# EAGLE design soloG (EAGLE 6.4)
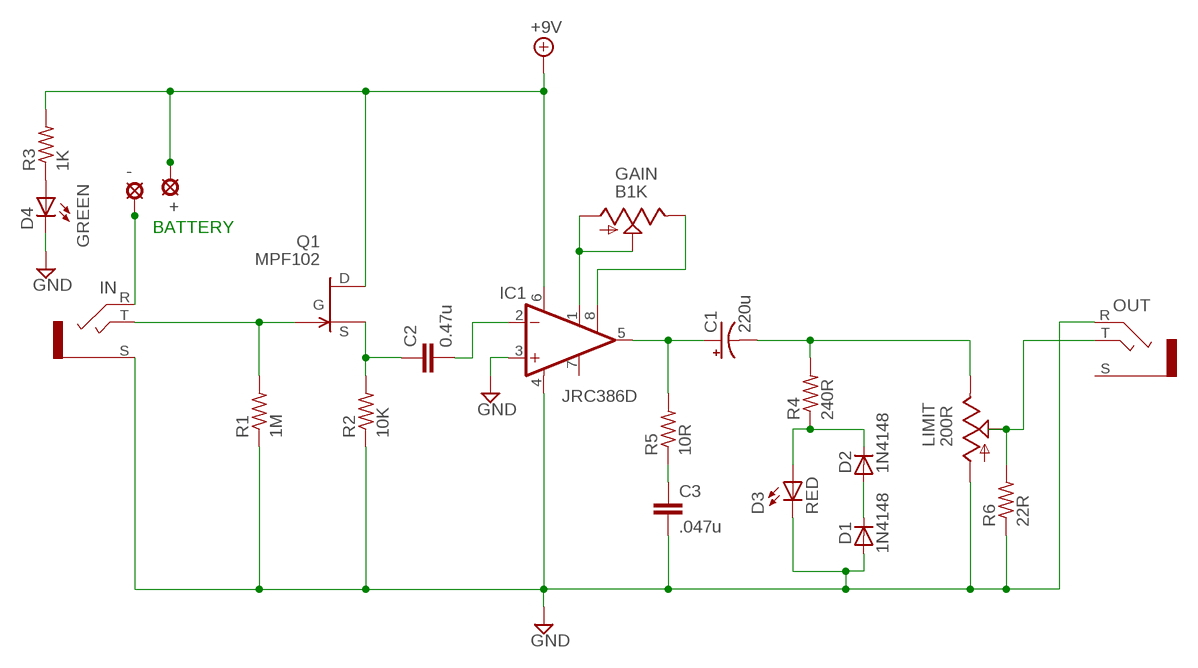
[diagram p0: schematic, sheet 1]

## Parts
+  SOLPAD  [SOLPAD]
-  SOLPAD  [SOLPAD]
C1  220u  CPOL-USE3.5-8  [E3,5-8]
C2  0.47u  C15/5  [C15B5]
C3  .047u  C-EUGREEN-CHIKLET  [C075-040X085_OVAL]
D1  1N4148  1N4148DO35-7  [DO35-7]
D2  1N4148  1N4148DO35-7  [DO35-7]
D3  RED  LED3MM  [LED3MM]
D4  GREEN  LED3MM  [LED3MM]
GAIN  B1K  TRIM_US-PTD901-2015K  [PTD901-2015K]
IC1  JRC386D  [DIP8]
IN  NRJ6-STEREO-HH  [NRJ6HH]
LIMIT  200R  TRIM_US-0655H  [0655-614]
OUT  NRJ6-STEREO-HH  [NRJ6HH]
Q1  MPF102  [TO92-FET]
R1  1M  R-US_0207/7  [0207/7]
R2  10K  R-US_0207/7  [0207/7]
R3  1K  R-US_0207/7  [0207/7]
R4  240R  R-US_0207/7  [0207/7]
R5  10R  R-US_0207/7  [0207/7]
R6  22R  R-US_0207/7  [0207/7]

## Nets
+9V: +.1(MP) IC1.6(VS) Q1.D R3.2
GND: C3.P$2 D1.A D3.K(C) D4.K(C) IC1.3(+IN) IC1.4(GND) IN.S LIMIT.A OUT.R R1.1 R2.1 R6.1
N$1: C1.+ IC1.5(OUT) R5.2
N$2: C2.1 Q1.S R2.2
N$3: GAIN.1(A) GAIN.2(S) IC1.1(GAIN)
N$4: C2.2 IC1.2(-IN)
N$5: -.1(MP) IN.R
N$6: IN.T Q1.G R1.2
N$7: C3.P$1 R5.1
N$8: LIMIT.S OUT.T R6.2
N$9: GAIN.3(E) IC1.8(GAIN)
N$10: D4.A R3.1
N$11: D2.C D3.A R4.1
N$12: C1.- LIMIT.E R4.2
N$14: D1.C D2.A
Unconnected: IC1.7(BYPASS) OUT.S

## Notes on the sheet
- BATTERY

## Library data of the parts
+ - = KK:SOLPAD: Simple solder pad
C1 = rcl:CPOL-US: POLARIZED CAPACITOR, American symbol
C2 = capacitor-wima:C: CAPACITOR naming: grid - package width
C3 = rcl-KK:C-EU: CAPACITOR, European symbol
D1 D2 = diode:1N4148: DIODE high speed (Philips)
D3 D4 = led:LED: LED OSRAM: - CHIPLED LG R971, LG N971, LY N971, LG Q971, LY Q971, LO R971, LY R971 LH N974, LH R974 LS Q976, LO Q976, LY Q976 LO Q996 - Hyper CHIPLED LW Q18S LB Q993, LB Q99A, LB R99A - SideLED LS A670, LO A670, LY A670, LG A670, LP A670 LB A673, LV A673, LT A673, LW A673 LH A674 LY A675 LS A676, LA A676, LO A676, LY A676, LW A676 LS A679, LY A679, LG A679 - Hyper Micro SIDELED® LS Y876, LA Y876, LO Y876, LY Y876 LT Y87S - SmartLED LW L88C, LW L88S LB L89C, LB L89S, LG L890 LS L89K, LO L89K, LY L89K LS L896, LA L896, LO L896, LY L896 - TOPLED LS T670, LO T670, LY T670, LG T670, LP T670 LSG T670, LSP T670, LSY T670, LOP T670, LYG T670 LG T671, LOG T671, LSG T671 LB T673, LV T673, LT T673, LW T673 LH T674 LS T676, LA T676, LO T676, LY T676, LB T676, LH T676, LSB T676, LW T676 LB T67C, LV T67C, LT T67C, LS T67K, LO T67K, LY T67K, LW E67C LS E67B, LA E67B, LO E67B, LY E67B, LB E67C, LV E67C, LT E67C LW T67C LS T679, LY T679, LG T679 LS T770, LO T770, LY T770, LG T770, LP T770 LB T773, LV T773, LT T773, LW T773 LH T774 LS E675, LA E675, LY E675, LS T675 LS T776, LA T776, LO T776, LY T776, LB T776 LHGB T686 LT T68C, LB T68C - Hyper Mini TOPLED® LB M676 - Mini TOPLED Santana® LG M470 LS M47K, LO M47K, LY M47K Source: http://www.osram.convergy.de LUXEON: - LUMILED® LXK2-PW12-R00, LXK2-PW12-S00, LXK2-PW14-U00, LXK2-PW14-V00 LXK2-PM12-R00, LXK2-PM12-S00, LXK2-PM14-U00 LXK2-PE12-Q00, LXK2-PE12-R00, LXK2-PE12-S00, LXK2-PE14-T00, LXK2-PE14-U00 LXK2-PB12-K00, LXK2-PB12-L00, LXK2-PB12-M00, LXK2-PB14-N00, LXK2-PB14-P00, LXK2-PB14-Q00 LXK2-PR12-L00, LXK2-PR12-M00, LXK2-PR14-Q00, LXK2-PR14-R00 LXK2-PD12-Q00, LXK2-PD12-R00, LXK2-PD12-S00 LXK2-PH12-R00, LXK2-PH12-S00 LXK2-PL12-P00, LXK2-PL12-Q00, LXK2-PL12-R00 Source: www.luxeon.com KINGBRIGHT: KA-3528ASYC Source: www.kingbright.com
GAIN LIMIT = KK-pot:TRIM_US-: POTENTIOMETER
IC1 = linear:JRC386: JRC386D Japan Radio version of LM386 Op Amp
IN OUT = KK-con:NRJ6-STEREO: Neutrik slim 1/4" jack Panel cutout 0.441"
Q1 = transistor-fet:MPF102: MPF102 n-JFET
R1-R6 = rcl:R-US_: RESISTOR, American symbol

## Board
Boxed Kit Amps SoloG Pocket Guitar Amp licensed under Creative Commons CC BY-SA-NC 2.5 Contact: http://www.boxedkitamps.com Open Source: https://github.com/boxedkitamps/SoloG
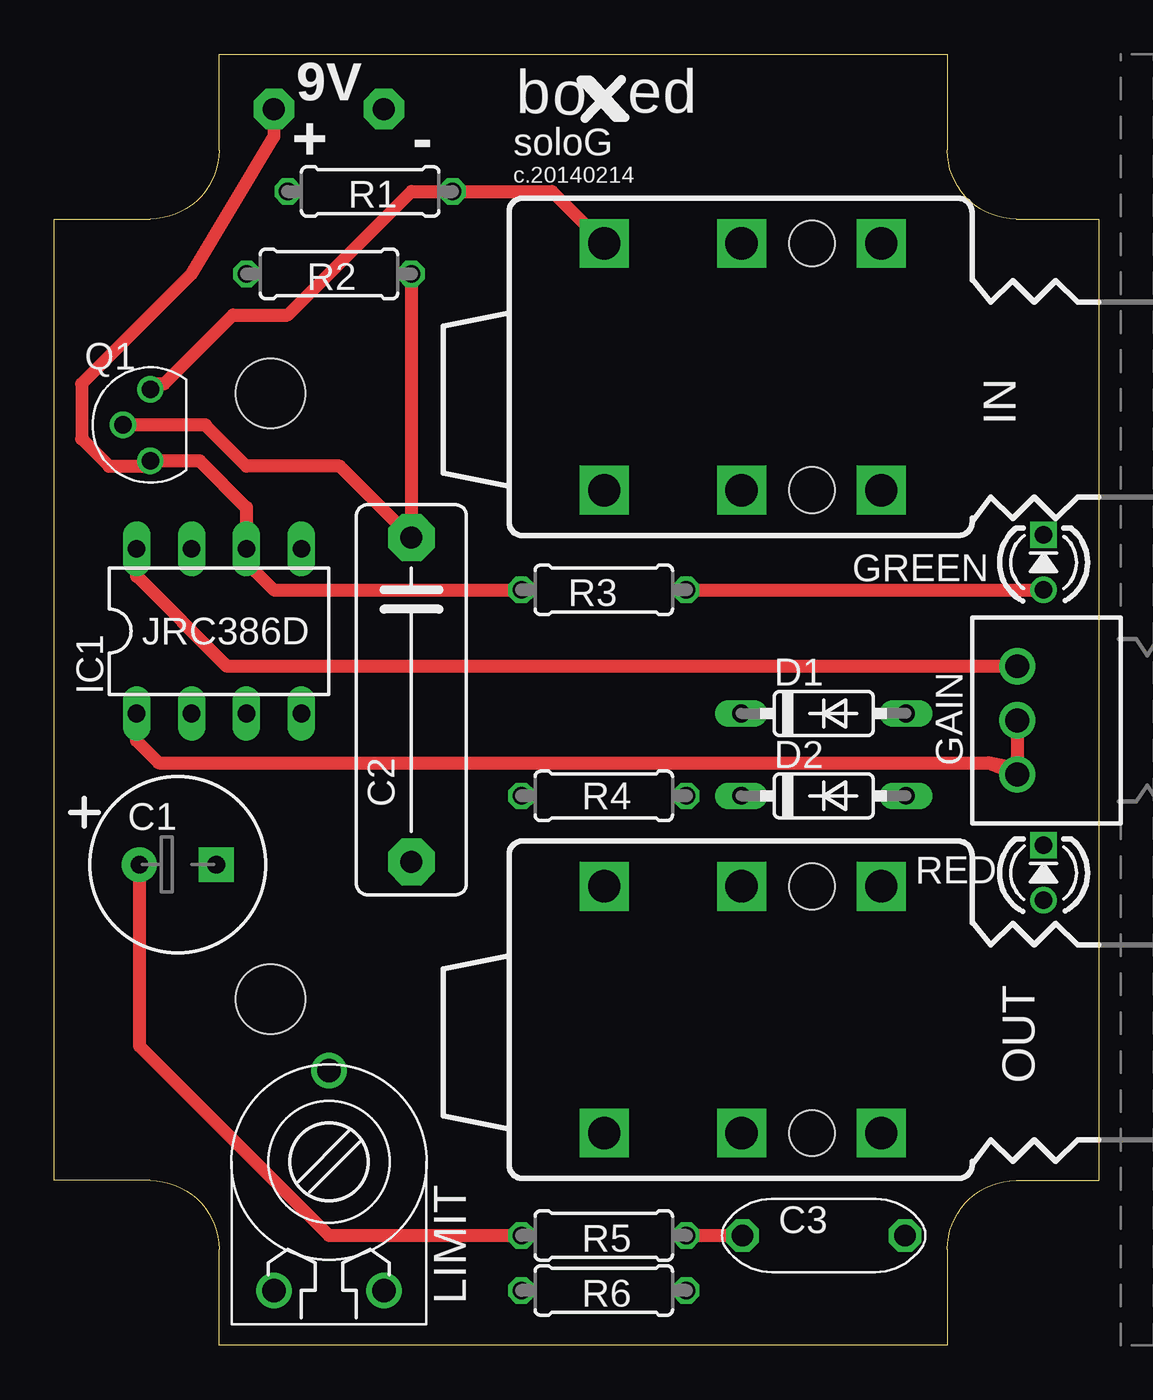
[diagram p1: board, top side]
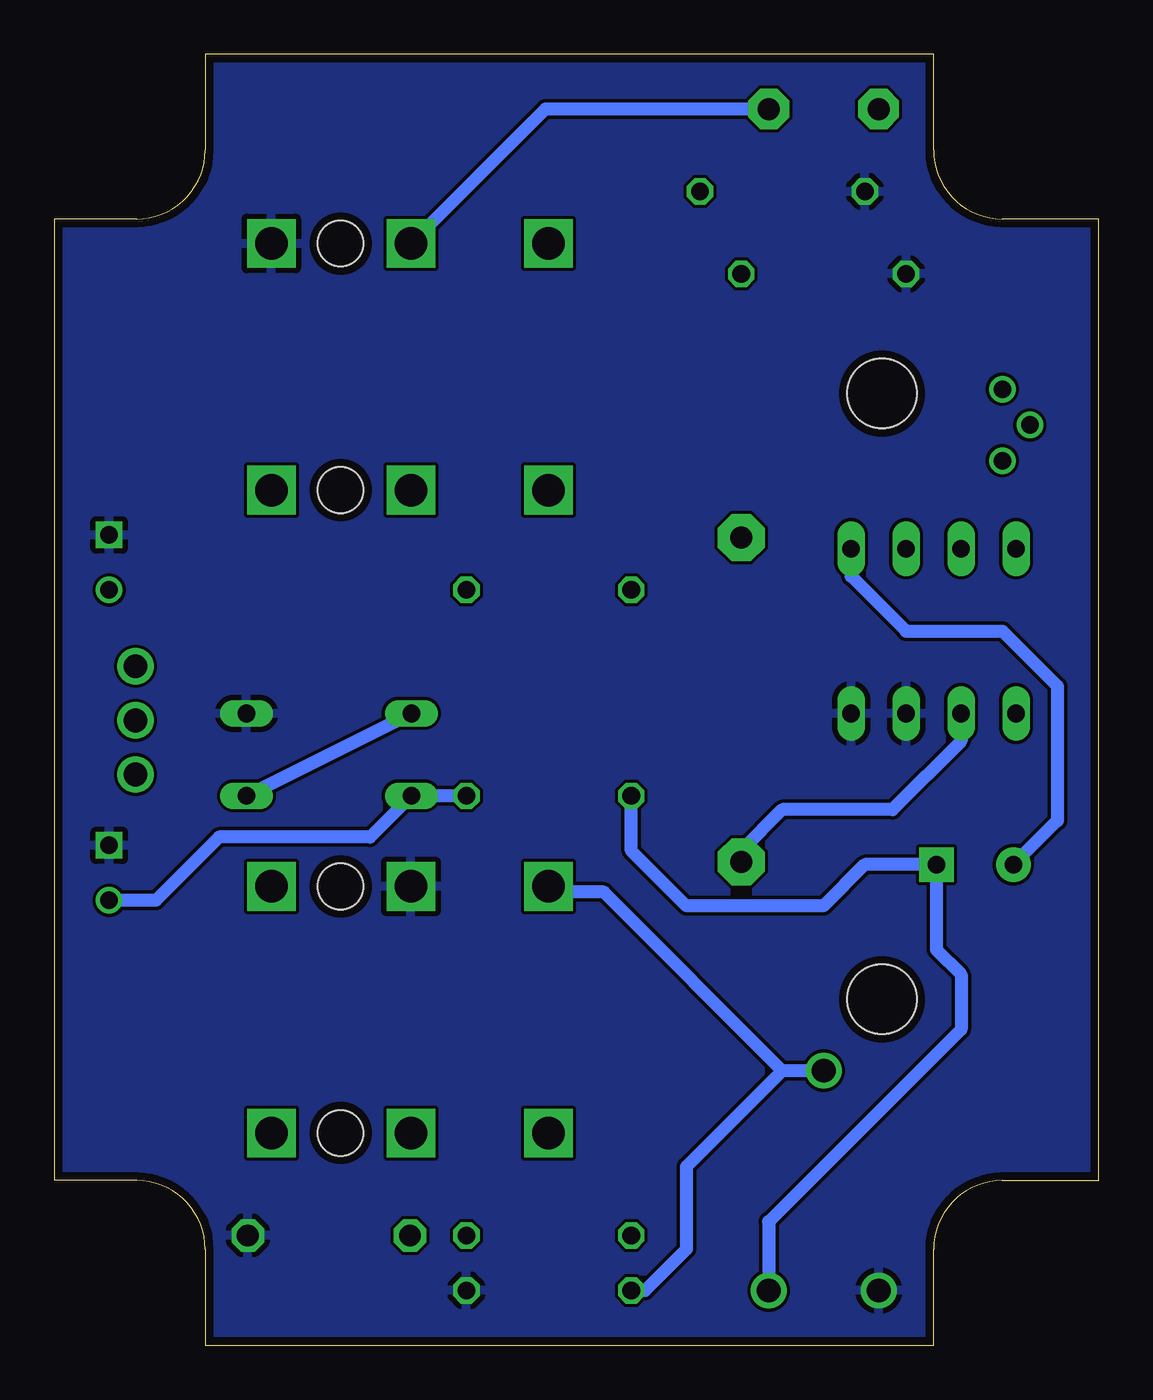
[diagram p2: board, bottom side, seen from below]

Size 48.26 x 59.69 mm. Coordinates in mm from the lower left corner, seen from the top.
Outline: 0,7.62 0,52.07 4.45,52.07 arc90 7.62,55.24 7.62,59.69 41.27,59.69 41.27,55.24 arc90 44.45,52.07 48.26,52.07 48.26,7.62 44.45,7.62 arc90 41.27,4.45 41.27,0 7.62,0 7.62,4.45 arc90 4.45,7.62 0,7.62
Copper layers (1*16): Top 0.0356mm / dielectric 1.5011mm / Bottom 0.0356mm
Design rules "LaenPCBOrder": minimum track width 6mil, minimum drill 13mil, track to track 6mil, track to pad 6mil, pad to pad 6mil, via to via 6mil, smd to smd 6mil, copper to edge 15mil, drill to drill 6mil, minimum pad ring 7mil, minimum via ring 7mil, stop-mask expansion 4mil, vias tented up to drill 0mil, thermal gap 10mil
Holes 3.2 mm at 10,16 10,44
bKeepout: area 36.7,42.7 to 39.3,45.3; area 8.7,42.7 to 11.3,45.3; area 36.7,14.7 to 39.3,17.3; area 8.7,14.7 to 11.3,17.3

### Footprints (pad centres in the part's own frame; a part is rotated, then mirrored left to right if it is on the bottom)
SOLPAD = drill 1.016 pad 1.88 octagon: 1 0,0
E3,5-8 = drill 0.813 pad 1.6: + -1.778,0 | drill 0.813 pad 1.6 square: - 1.778,0
C15B5 = drill 1.016 pad 2.159 octagon: 1 -7.493,0; 2 7.493,0
C075-040X085_OVAL = drill 1 octagon: P$1 -3.75,0; P$2 3.75,0
DO35-7 = drill 0.813 long: A 3.81,0; C -3.81,0
LED3MM = drill 0.813: A -1.27,0 | drill 0.813 square: K 1.27,0
PTD901-2015K = drill 1.1 pad 1.676: 1 0,-2.5; 2 0,0; 3 0,2.5
DIP8 = drill 0.813 pad 1.27 long: 1 -3.81,-3.81; 2 -1.27,-3.81; 3 1.27,-3.81; 4 3.81,-3.81; 5 3.81,3.81; 6 1.27,3.81; 7 -1.27,3.81; 8 -3.81,3.81
NRJ6HH = drill 1.5 square: R -2.52,5.216; RN -2.52,-6.184; S 3.93,5.216; SN 3.93,-6.184; T -8.87,5.216; TN -8.87,-6.184 | hole 2.1: 0.73,5.216; 0.73,-6.184
0655-614 = drill 1.1: A -2.54,-5.08; E 2.54,-5.08; S 0,5.08
TO92-FET = drill 0.813: D -1.651,0; G 1.651,0; S 0,1.27
0207/7 = drill 0.813 octagon: 1 -3.81,0; 2 3.81,0

### Placement (x,y rotation side)
+  10.16,57.15 0 top
-  15.24,57.15 0 top
C1  5.71,22.23 0 top
C2  16.51,29.84 270 top
C3  35.56,5.08 0 top
D1  35.56,29.21 0 top
D2  35.56,25.4 0 top
D3  45.72,21.84 90 top
D4  45.72,36.2 90 top
GAIN  44.5,28.89 0 top
IC1  7.62,33.02 0 top
IN  34.29,45.72 0 top
LIMIT  12.7,7.62 0 top
OUT  34.29,16 0 top
Q1  4.45,42.55 90 top
R1  14.61,53.34 0 top
R2  12.7,49.53 0 top
R3  25.4,34.92 180 top
R4  25.4,25.4 180 top
R5  25.4,5.08 180 top
R6  25.4,2.54 180 top

### Tracks (layer width: path | path; a pad name or v marks a point on that pad's centre or on a via)
+9V
  Top 0.61: +.1 10.16,55.88 6.35,49.53 1.27,44.45 1.27,41.91 2.54,40.64 4.19,40.64 Q1.D 6.73,40.89 8.89,38.73 IC1.6 8.89,36.2 10.16,34.92 R3.2
GND
  pour Bottom: 0,59.69 48.26,59.69 48.26,0 0,0
N$1
  Top 0.61: C1.+ 3.94,13.84 12.7,5.08 R5.2
  Bottom 0.61: IC1.5 11.43,35.56 8.89,33.02 4.45,33.02 1.91,30.48 1.91,24.26 C1.+
N$2
  Top 0.61: R2.2 C2.1 13.21,40.64 8.89,40.64 6.99,42.55 Q1.S
N$3
  Top 0.61: IC1.1 3.81,27.94 4.83,26.92 43.18,26.92 | 44.45,26.67 43.18,26.92 | 43.18,26.92 GAIN.1 GAIN.2
N$4
  Bottom 0.61: IC1.2 6.35,27.94 9.53,24.77 14.61,24.77 16.51,22.86 C2.2
N$5
  Bottom 0.61: -.1 25.56,57.15 IN.R
N$6
  Top 0.61: IN.T 23.02,53.34 R1.2 16.51,53.34 10.79,47.62 8.26,47.62 5.08,44.45 4.7,44.45 Q1.G
N$7
  Top 0.61: R5.1 C3.P$1
N$8
  Bottom 0.61: LIMIT.S 14.61,12.7 | 14.61,12.7 22.86,20.95 25.16,20.95 OUT.T | 14.61,12.7 19.05,8.26 19.05,4.45 20.95,2.54 R6.2
N$9
  Top 0.61: GAIN.3 7.98,31.39 3.81,35.56 IC1.8
N$10
  Top 0.61: R3.1 D4.A
N$11
  Bottom 0.61: R4.1 D2.C 33.66,23.5 40.64,23.5 43.56,20.57 D3.A
N$12
  Bottom 0.61: R4.2 21.59,22.86 19.05,20.32 12.7,20.32 10.79,22.23 C1.- 7.49,18.29 6.35,17.14 6.35,14.61 15.24,5.71 LIMIT.E
N$14
  Bottom 0.61: D2.A D1.C

### Text on the board
tPlace: 9V | b | o | e | d | soloG | c.20140214